# EasyEDA Pro project Ai-Camera.eprj, schematic Schematic1

## Sheets
1 P1: Board Name: Board1; Create Date: 2025-08-22; Page Name: P1; Project Name: Ai-Camera; Schematic Name: Schematic1; Update Date: 2026-03-01; Company: EasyEDA.com; Page Size: A4; Version: V1.0
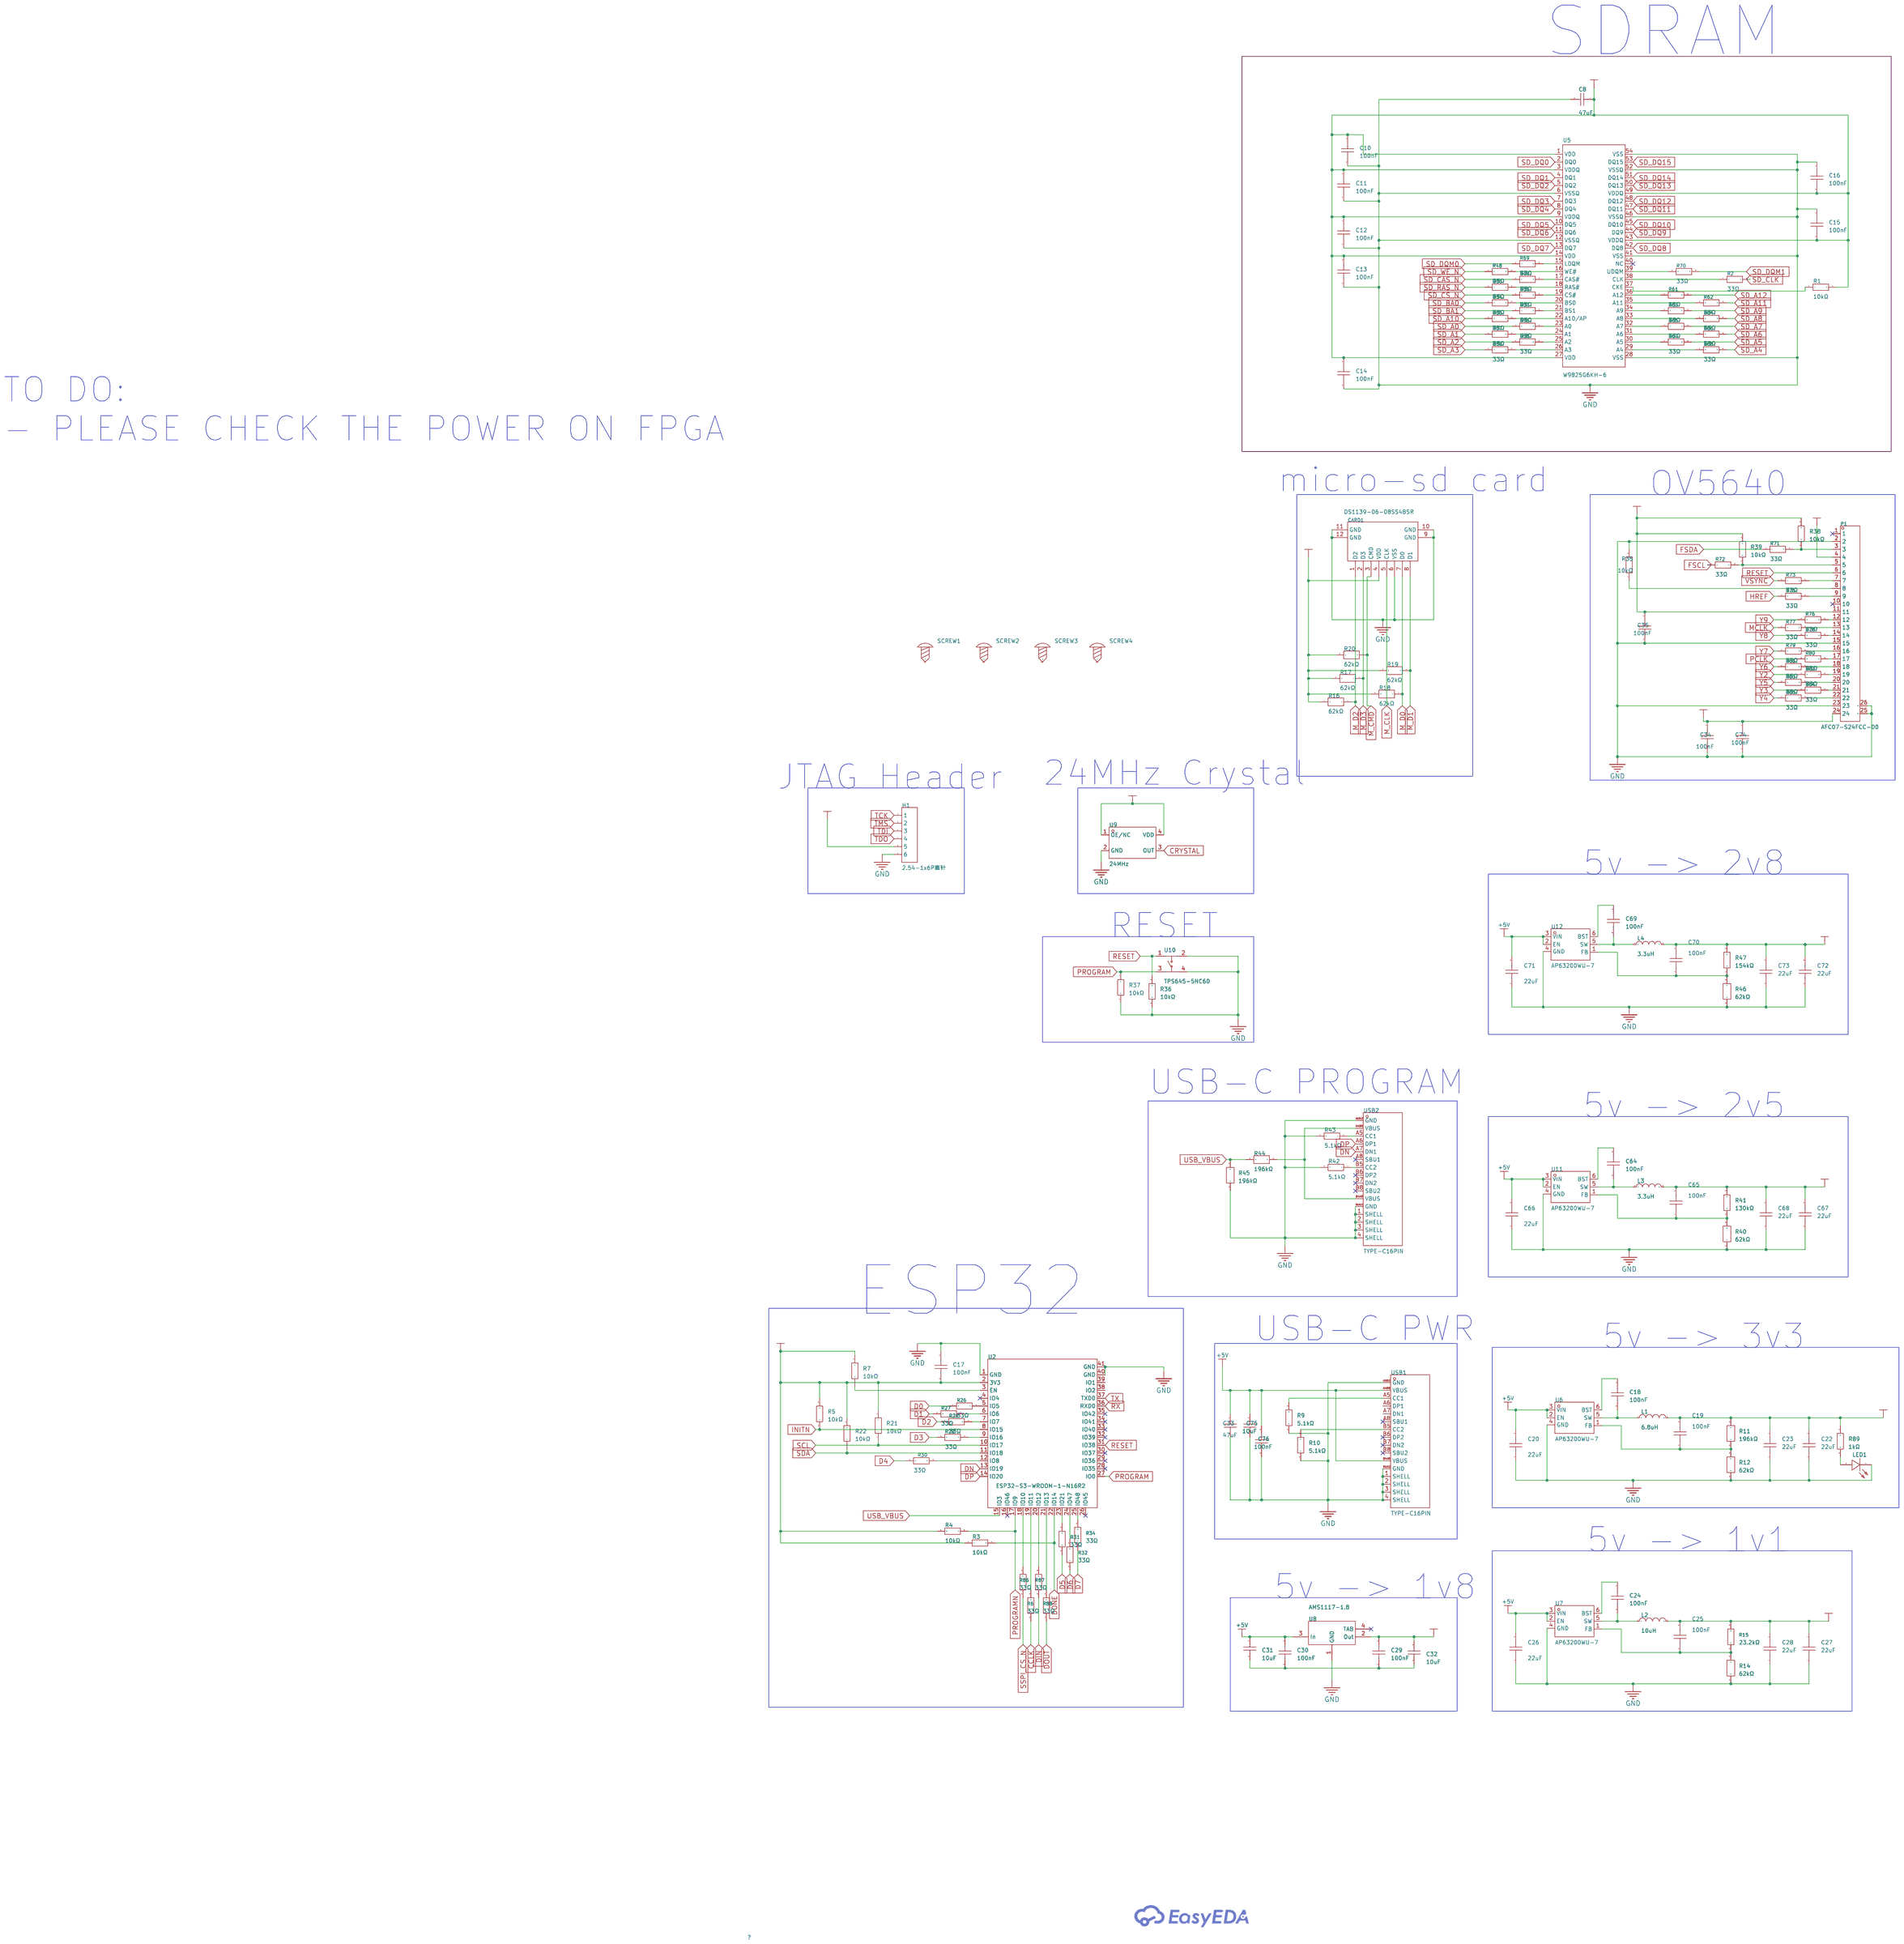
[diagram p0: P1]
2 FPGA: Create Date: 2026-01-28; Page Name: FPGA; Update Date: 2026-02-28
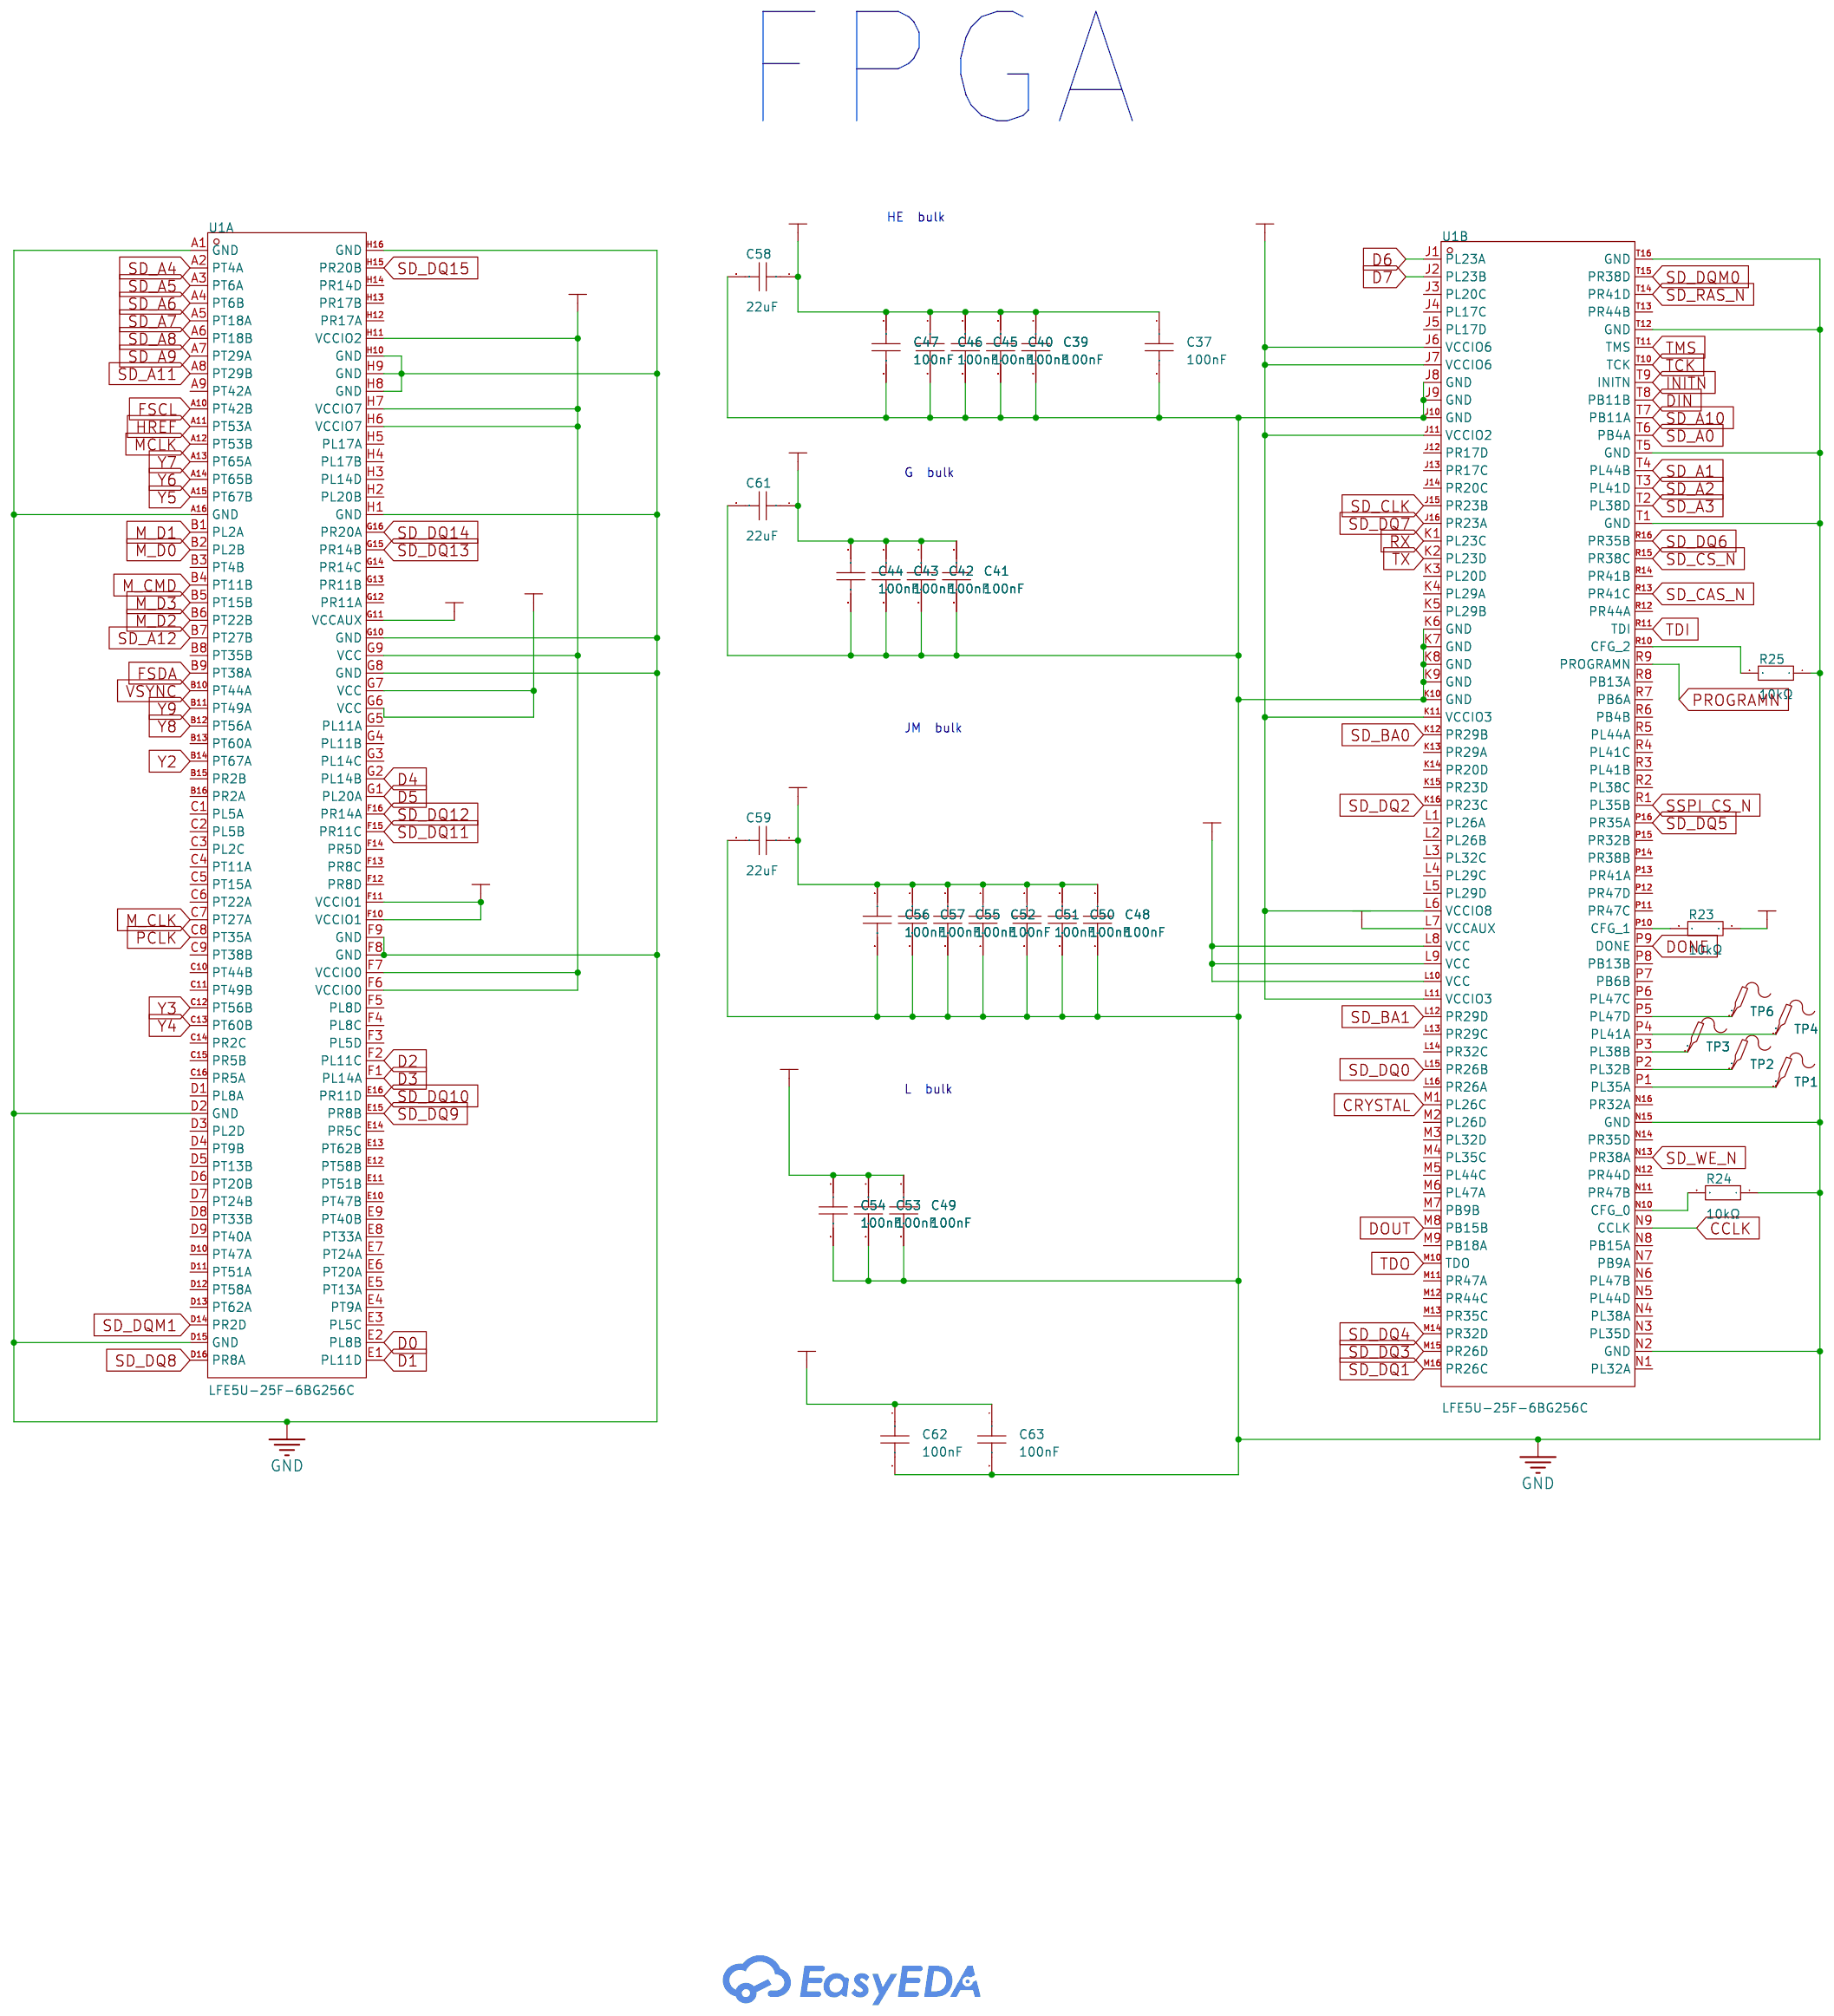
[diagram p1: FPGA]

## Parts
sheet FPGA
C37  100nF  [C01005]
C39  100nF  [C01005]
C40  100nF  [C01005]
C41  100nF  [C01005]
C42  100nF  [C01005]
C43  100nF  [C01005]
C44  100nF  [C01005]
C45  100nF  [C01005]
C46  100nF  [C01005]
C47  100nF  [C01005]
C48  100nF  [C01005]
C49  100nF  [C01005]
C50  100nF  [C01005]
C51  100nF  [C01005]
C52  100nF  [C01005]
C53  100nF  [C01005]
C54  100nF  [C01005]
C55  100nF  [C01005]
C56  100nF  [C01005]
C57  100nF  [C01005]
C58  22uF  [C0603]
C59  22uF  [C0603]
C61  22uF  [C0603]
C62  100nF  [C01005]
C63  100nF  [C01005]
R23  10kΩ  [R0402]
R24  10kΩ  [R0402]
R25  10kΩ  [R0402]
TP1  -  [Test-Point-0.5mm]
TP2  -  [Test-Point-0.5mm]
TP3  -  [Test-Point-0.5mm]
TP4  -  [Test-Point-0.5mm]
TP6  -  [Test-Point-0.5mm]
U1  LFE5U-25F-6BG256C  [CABGA-256_L14.0-W14.0-R16-C16-P0.80-TL]  (sections 1,2)
sheet P1
C8  47uF  [C0805]
C10  100nF  [C01005]
C11  100nF  [C01005]
C12  100nF  [C01005]
C13  100nF  [C01005]
C14  100nF  [C01005]
C15  100nF  [C01005]
C16  100nF  [C01005]
C17  100nF  [C01005]
C18  100nF  [C01005]
C19  100nF  [C0603]
C20  22uF  [C0603]
C22  22uF  [C0603]
C23  22uF  [C0603]
C24  100nF  [C01005]
C25  100nF  [C0603]
C26  22uF  [C0603]
C27  22uF  [C0603]
C28  22uF  [C0603]
C29  100nF  [C01005]
C30  100nF  [C01005]
C31  10uF  [C0402]
C32  10uF  [C0402]
C33  47uF  [C0805]
C34  100nF  [C01005]
C35  100nF  [C01005]
C64  100nF  [C01005]
C65  100nF  [C0603]
C66  22uF  [C0603]
C67  22uF  [C0603]
C68  22uF  [C0603]
C69  100nF  [C01005]
C70  100nF  [C0603]
C71  22uF  [C0603]
C72  22uF  [C0603]
C73  22uF  [C0603]
C74  100nF  [C01005]
C75  10uF  [C0402]
C76  100nF  [C01005]
CARD1  DS1139-06-08SS4BSR  [TF-SMD_DS1139-06-08SS4BSR]
H1  2.54-1x6P直针  [HDR-TH_6P-P2.54-V-M-1]
L1  6.8uH  [IND-SMD_L7.0-W6.6]
L2  10uH  [IND-SMD_L7.3-W6.8]
L3  3.3uH  [IND-SMD_L4.5-W4.1_SL0420]
L4  3.3uH  [IND-SMD_L4.5-W4.1_SL0420]
LED1  -  [LED0805-RD_RED]
P1  AFC07-S24FCC-00  [FPC-SMD_AFC07-S24FCC-00]
R1  10kΩ  [R0402]
R2  33Ω  [R0402]
R3  10kΩ  [R0402]
R4  10kΩ  [R0402]
R5  10kΩ  [R0402]
R6  33Ω  [R0402]
R7  10kΩ  [R0402]
R9  5.1kΩ  [R0603]
R10  5.1kΩ  [R0603]
R11  196kΩ  [R0603]
R12  62kΩ  [R0603]
R14  62kΩ  [R0603]
R15  23.2kΩ  [R0603]
R16  62kΩ  [R0603]
R17  62kΩ  [R0603]
R18  62kΩ  [R0603]
R19  62kΩ  [R0603]
R20  62kΩ  [R0603]
R21  10kΩ  [R0402]
R22  10kΩ  [R0402]
R26  33Ω  [R0402]
R27  33Ω  [R0402]
R28  33Ω  [R0402]
R29  33Ω  [R0402]
R30  33Ω  [R0402]
R31  33Ω  [R0402]
R32  33Ω  [R0402]
R34  33Ω  [R0402]
R35  10kΩ  [R0402]
R36  10kΩ  [R0402]
R37  10kΩ  [R0402]
R38  10kΩ  [R0402]
R39  10kΩ  [R0402]
R40  62kΩ  [R0603]
R41  130kΩ  [R0402]
R42  5.1kΩ  [R0603]
R43  5.1kΩ  [R0603]
R44  196kΩ  [R0603]
R45  196kΩ  [R0603]
R46  62kΩ  [R0603]
R47  154kΩ  [R0402]
R48  33Ω  [R0402]
R49  33Ω  [R0402]
R50  33Ω  [R0402]
R51  33Ω  [R0402]
R53  33Ω  [R0402]
R54  33Ω  [R0402]
R55  33Ω  [R0402]
R56  33Ω  [R0402]
R57  33Ω  [R0402]
R58  33Ω  [R0402]
R59  33Ω  [R0402]
R61  33Ω  [R0402]
R62  33Ω  [R0402]
R63  33Ω  [R0402]
R64  33Ω  [R0402]
R65  33Ω  [R0402]
R66  33Ω  [R0402]
R67  33Ω  [R0402]
R68  33Ω  [R0402]
R69  33Ω  [R0402]
R70  33Ω  [R0402]
R71  33Ω  [R0402]
R72  33Ω  [R0402]
R73  33Ω  [R0402]
R75  33Ω  [R0402]
R76  33Ω  [R0402]
R77  33Ω  [R0402]
R78  33Ω  [R0402]
R79  33Ω  [R0402]
R80  33Ω  [R0402]
R81  33Ω  [R0402]
R82  33Ω  [R0402]
R83  33Ω  [R0402]
R84  33Ω  [R0402]
R85  33Ω  [R0402]
R86  33Ω  [R0402]
R87  33Ω  [R0402]
R88  33Ω  [R0402]
R89  1kΩ  [R1206]
SCREW1  -  [Screw-Hole-M2]
SCREW2  -  [Screw-Hole-M3]
SCREW3  -  [Screw-Hole-M3]
SCREW4  -  [Screw-Hole-M3]
U2  ESP32-S3-WROOM-1-N16R2  [WIRELM-SMD_ESP32-S3-WROOM-1]
U5  W9825G6KH-6  [TSOP-54_L22.2-W10.2-P0.80-LS11.8-BL]
U6  AP63200WU-7  [SOT-23-6_L2.9-W1.6-P0.95-LS2.8-BR]
U7  AP63200WU-7  [SOT-23-6_L2.9-W1.6-P0.95-LS2.8-BR]
U8  AMS1117-1.8  [SOT-223-4_L6.5-W3.5-P2.30-LS7.0-BR]
U9  24MHz  [OSC-SMD_4P-L3.2-W2.5-BL]
U10  TPS645-5NC60  [SW-SMD_4P-L6.0-W6.0-P4.50-LS9.2]
U11  AP63200WU-7  [SOT-23-6_L2.9-W1.6-P0.95-LS2.8-BR]
U12  AP63200WU-7  [SOT-23-6_L2.9-W1.6-P0.95-LS2.8-BR]
USB1  TYPE-C16PIN  [USB-C-SMD_TYPE-C16PIN]
USB2  TYPE-C16PIN  [USB-C-SMD_TYPE-C16PIN]

## Library data of the parts
C10-C18 C24 C29 C30 C34 C35 C37 C39-C57 C62-C64 C69 C74 C76 = GRM022R60J104KE15D: LCSC Part Name: 100nF ±10% 6.3V; Supplier Part: C161362; Manufacturer: muRata(村田); Supplier Footprint: 01005; JLCPCB Part Class: Extended Part; Datasheet: https://atta.szlcsc.com/upload/public/pdf/source/20200305/C490387_23319AE8C154DEB24C505E6C82A8106A.pdf; Supplier: LCSC; Tolerance: ±10%; Voltage Rating: 6.3V; Temperature Coefficient: X5R
C20 C22 C23 C26-C28 C58 C59 C61 C66-C68 C71-C73 = TCC0603X5R226M6R3CT: LCSC Part Name: 22uF ±20% 6.3V; Supplier Part: C380323; Manufacturer: CCTC(三环); Supplier Footprint: 0603; JLCPCB Part Class: Extended Part; Datasheet: https://item.szlcsc.com/datasheet/TCC0603X5R226M6R3CT/352728.html; Supplier: LCSC; Tolerance: ±20%; Voltage Rating: 6.3V; Temperature Coefficient: X5R
R1 R3-R5 R7 R21-R25 R35-R39 = 0402WGF1002TCE: LCSC Part Name: 10kΩ ±1% 62.5mW 厚膜电阻; Supplier Part: C25744; Manufacturer: UNI-ROYAL(厚声); Supplier Footprint: 0402; JLCPCB Part Class: Basic Part; Datasheet: https://item.szlcsc.com/datasheet/0402WGF1002TCE/26487.html; Supplier: LCSC; Type: Thick Film Resistor; Tolerance: ±1%; Power(Watts): 62.5mW; Voltage-Supply(Max): 50V; Temperature Coefficient: ±100ppm/℃; Operating Temperature: -55℃~+155℃
TP1-TP4 TP6 = Test-Point
U1 = LFE5U-25F-6BG256C: LCSC Part Name: LFE5U 25F 6BG256C; Supplier Part: C1521614; Manufacturer: LATTICE(莱迪思); Supplier Footprint: CABGA-256; JLCPCB Part Class: Extended Part; Datasheet: https://atta.szlcsc.com/upload/public/pdf/source/20221202/6704A1754335A6F4ED4829569A52AB14.pdf; Supplier: LCSC; Logic Elements / Cells: 24000; Logic Array Blocks: 6000; Embedded Block RAM: 1032192bit; Operating Temperature Range: 0℃~+85℃
C8 C33 = CL21A476MQYNNNE: LCSC Part Name: 47uF ±20% 6.3V; Supplier Part: C16780; Manufacturer: SAMSUNG(三星); Supplier Footprint: 0805; JLCPCB Part Class: Basic Part; Datasheet: https://item.szlcsc.com/datasheet/CL21A476MQYNNNE/17464.html; Supplier: LCSC; Tolerance: ±20%; Voltage Rating: 6.3V; Temperature Coefficient: X5R
C19 C25 C65 C70 = TCC0603X7R104K500CT: LCSC Part Name: 100nF ±10% 50V; Supplier Part: C282519; Manufacturer: CCTC(三环); Supplier Footprint: 0603; JLCPCB Part Class: Extended Part; Datasheet: https://item.szlcsc.com/datasheet/TCC0603X7R104K500CT/268639.html; Supplier: LCSC; Tolerance: ±10%; Voltage Rating: 50V; Temperature Coefficient: X7R
C31 C32 C75 = GRM155R60J106ME44D: LCSC Part Name: 10uF ±20% 6.3V; Supplier Part: C76991; Manufacturer: muRata(村田); Supplier Footprint: 0402; JLCPCB Part Class: Extended Part; Datasheet: https://item.szlcsc.com/datasheet/GRM155R60J106ME44D/78118.html; Supplier: LCSC; Tolerance: ±20%; Voltage Rating: 6.3V; Temperature Coefficient: X5R
CARD1 = DS1139-06-08SS4BSR: LCSC Part Name: 翻盖式 MicroSD卡(TF卡) 卡座; Supplier Part: C86574; Manufacturer: CONNFLY; Supplier Footprint: SMD; JLCPCB Part Class: Extended Part; Datasheet: https://item.szlcsc.com/datasheet/DS1139-06-08SS4BSR/87751.html; Supplier: LCSC; Card Connection Mode: Hinged Lid; Card Type: MicroSD Card (TF Card); Connector Type: Connector and Ejector
H1 = 2.54-1x6P直针: LCSC Part Name: 1x6P 间距:2.54mm 方针 直插; Supplier Part: C37208; Manufacturer: BOOMELE(博穆精密); Supplier Footprint: 插件,P=2.54mm; JLCPCB Part Class: Extended Part; Datasheet: https://item.szlcsc.com/datasheet/2.54-1x6P%25E7%259B%25B4%25E9%2592%2588/38187.html; Supplier: LCSC; Pin Structure: 1x6P; Pitch: 2.54mm; Circluar Pins/Square Pins: Pin Header; Mounting Type: Through Hole; Number of Rows: 1; Number of Pins: 6P; Current Rating: 3A; Length of Mating Pin: 6mm; Insulation Height: 2.5mm; Length of End Connection Pin: 3mm; Contact Material: Brass; Contact Plating: Gold; Operating Temperature: -40℃~+105℃; Color: Black
L1 = FXL0630-6R8-M: LCSC Part Name: 6.8uH ±20% 6A; Supplier Part: C167221; Manufacturer: cjiang(长江微电); Supplier Footprint: SMD,7x6.6mm; JLCPCB Part Class: Extended Part; Datasheet: https://item.szlcsc.com/datasheet/FXL0630-6R8-M/178604.html; Supplier: LCSC; Tolerance: ±20%; Current Rating: 5A; Current - Saturation(Isat): 6A; DC Resistance(DCR): 48mΩ; Type: Molded Inductor
L2 = FXL0630-100-M: LCSC Part Name: 10uH ±20% 5.5A; Supplier Part: C167223; Manufacturer: cjiang(长江微电); Supplier Footprint: SMD,6.6x7mm; JLCPCB Part Class: Extended Part; Datasheet: https://atta.szlcsc.com/upload/public/pdf/source/20240426/3189EA8206330E2108542F9E34E540E7.pdf; Supplier: LCSC; Tolerance: ±20%; Saturation Current (Isat): 5.5A; Type: Integrated molded inductor
L3 L4 = SL0420-3R3M: LCSC Part Name: 3.3uH ±20% 4A; Supplier Part: C22463807; Manufacturer: 台湾陆海; Supplier Footprint: SMD,4.5x4.1mm; JLCPCB Part Class: Extended Part; Datasheet: https://item.szlcsc.com/datasheet/SL0420-3R3M/24154949.html; Supplier: LCSC; Tolerance: ±20%; Current Rating: 3.5A; Current - Saturation (Isat): 4A
LED1 = NCD0805R1: LCSC Part Name: 红灯; Supplier Part: C84256; Manufacturer: 国星光电; Supplier Footprint: 0805; JLCPCB Part Class: Basic Part; Datasheet: https://atta.szlcsc.com/upload/public/pdf/source/20200820/C84256_F0A75A43B3EAD75808600A0514C76B99.pdf; Supplier: LCSC; Emitted Color: 红灯
P1 = AFC07-S24FCC-00: LCSC Part Name: 间距:0.5mm P数:24P 抽屉式 下接; Supplier Part: C11057; Manufacturer: JS(钜硕电子); Supplier Footprint: SMD,P=0.5mm,卧贴; JLCPCB Part Class: Extended Part; Datasheet: https://item.szlcsc.com/datasheet/AFC07-S24FCC-00/11604.html; Supplier: LCSC; Locking Feature: Slide Lock; Contact Type: Bottom Contact; Number of Contacts: 24P; Pitch: 0.5mm; Mounting Type: Surface Mount, Right Angle; FFC, FCB Thickness: 0.3mm; Height Above Board: 2mm
R2 R6 R26-R32 R34 R48-R51 R53-R59 R61-R73 R75-R88 = 0402WGF330JTCE: LCSC Part Name: 33Ω ±1% 62.5mW 厚膜电阻; Supplier Part: C25105; Manufacturer: UNI-ROYAL(厚声); Supplier Footprint: 0402; JLCPCB Part Class: Basic Part; Datasheet: https://item.szlcsc.com/datasheet/0402WGF330JTCE/25848.html; Supplier: LCSC; Type: Thick Film Resistor; Tolerance: ±1%; Power(Watts): 62.5mW; Voltage-Supply(Max): 50V; Temperature Coefficient: ±100ppm/℃; Operating Temperature: -55℃~+155℃
R9 R10 R42 R43 = 0603WAF5101T5E: LCSC Part Name: 5.1kΩ ±1% 100mW 厚膜电阻; Supplier Part: C23186; Manufacturer: UNI-ROYAL(厚声); Supplier Footprint: 0603; JLCPCB Part Class: Basic Part; Datasheet: https://item.szlcsc.com/datasheet/0603WAF5101T5E/23913.html; Supplier: LCSC; Type: Thick Film Resistor; Tolerance: ±1%; Power(Watts): 100mW; Voltage-Supply(Max): 75V; Temperature Coefficient: ±100ppm/℃; Operating Temperature: -55℃~+155℃
R11 R44 R45 = FRC0603F1963TS: LCSC Part Name: 196kΩ ±1% 100mW 厚膜电阻; Supplier Part: C2974032; Manufacturer: FOJAN(富捷); Supplier Footprint: 0603; JLCPCB Part Class: Extended Part; Supplier: LCSC; Type: Thick Film Resistor; Tolerance: ±1%; Power(Watts): 100mW; Voltage-Supply(Max): 75V; Temperature Coefficient: ±100ppm/℃; Operating Temperature: -55℃~+155℃
R12 R14 R16-R20 R40 R46 = FRC0603F6202TS: LCSC Part Name: 62kΩ ±1% 100mW 厚膜电阻; Supplier Part: C2907059; Manufacturer: FOJAN(富捷); Supplier Footprint: 0603; JLCPCB Part Class: Extended Part; Supplier: LCSC; Type: Thick Film Resistor; Tolerance: ±1%; Power(Watts): 100mW; Voltage-Supply(Max): 75V; Temperature Coefficient: ±100ppm/℃; Operating Temperature: -55℃~+155℃
R15 = 0603WAF2322T5E: LCSC Part Name: 23.2kΩ ±1% 100mW 厚膜电阻; Supplier Part: C23346; Manufacturer: UNI-ROYAL(厚声); Supplier Footprint: 0603; JLCPCB Part Class: Extended Part; Datasheet: https://item.szlcsc.com/datasheet/0603WAF2322T5E/24079.html; Supplier: LCSC; Type: Thick Film Resistor; Tolerance: ±1%; Power(Watts): 100mW; Voltage-Supply(Max): 75V; Temperature Coefficient: ±100ppm/℃; Operating Temperature: -55℃~+155℃
R41 = RC0402FR-07130KL: LCSC Part Name: 厚膜电阻 130kΩ ±1% 62.5mW; Supplier Part: C93946; Manufacturer: YAGEO(国巨); Supplier Footprint: 0402; JLCPCB Part Class: Extended Part; Datasheet: https://item.szlcsc.com/datasheet/RC0402FR-07130KL/95144.html; Supplier: LCSC; Type: Thick Film Resistor; Tolerance: ±1%; Power(Watts): 62.5mW; Voltage-Supply(Max): 50V; Temperature Coefficient: ±100ppm/℃; Operating Temperature: -55℃~+155℃
R47 = 0402WGF1543TCE: LCSC Part Name: 154kΩ ±1% 62.5mW 厚膜电阻; Supplier Part: C26993; Manufacturer: UNI-ROYAL(厚声); Supplier Footprint: 0402; JLCPCB Part Class: Extended Part; Datasheet: https://item.szlcsc.com/datasheet/0402WGF1543TCE/27742.html; Supplier: LCSC; Type: Thick Film Resistor; Tolerance: ±1%; Power(Watts): 62.5mW; Voltage-Supply(Max): 50V; Temperature Coefficient: ±100ppm/℃; Operating Temperature: -55℃~+155℃
R89 = 1206W4J0102T5E: LCSC Part Name: 1kΩ ±5%; Supplier Part: C1469; Manufacturer: UNI-ROYAL(厚声); Supplier Footprint: 1206; JLCPCB Part Class: Extended Part; Datasheet: https://atta.szlcsc.com/upload/public/pdf/source/20200306/C422600_1E6D84923E4A46A82E41ADD87F860B5C.pdf; Supplier: LCSC; Type: Thick Film Resistors; Power(Watts): 250mW
SCREW1 = Screw-Hole-M2: Supplier Footprint: 插件
SCREW2-SCREW4 = Screw-Hole-M3: Supplier Footprint: 插件
U2 = ESP32-S3-WROOM-1-N16R2: LCSC Part Name: 通用型Wi-Fi+低功耗蓝牙MCU模组; Supplier Part: C2913205; Manufacturer: ESPRESSIF(乐鑫); Supplier Footprint: SMD,25.5x18mm; JLCPCB Part Class: Extended Part; Datasheet: https://item.szlcsc.com/datasheet/ESP32-S3-WROOM-1-N16R2/3198303.html; Supplier: LCSC
U5 = W9825G6KH-6: LCSC Part Name: 4M×4存储体×16位SDRAM; Supplier Part: C62246; Manufacturer: Winbond(华邦); Supplier Footprint: TSOP-54-10.2mm; JLCPCB Part Class: Extended Part; Datasheet: https://item.szlcsc.com/datasheet/W9825G6KH-6/63303.html; Supplier: LCSC; Memory Size: 256Mbit; Clock Frequency: 166MHz; Voltage - Supply: 3V~3.6V; Operating Temperature: 0℃~+70℃
U6 U7 U11 U12 = AP63200WU-7: Function:Buck Voltage - Supply:3.8V~32V Voltage - Supply:3.8V~32V Output Voltage:- Output Voltage:- Output Current:2A Frequency - Switching:500kHz Frequency - Switching:500kHz Operating Temperature:-40℃~+85℃ Operating Temperature:-40℃~+85℃ Synchronous Rec; LCSC Part Name: 3.8V至32V输入、2A低静态电流同步降压转换器，增强EMI抑制; Supplier Part: C2071868; Manufacturer: DIODES(美台); Supplier Footprint: TSOT-23-6; JLCPCB Part Class: Extended Part; Datasheet: https://item.szlcsc.com/datasheet/AP63200WU-7/2163451.html; Supplier: LCSC; Function: Buck; Voltage - Supply: 3.8V~32V; Output Current: 2A; Frequency - Switching: 500kHz; Operating Temperature: -40℃~+85℃; Synchronous Rectifier: Yes; Number of Outputs: 1; Topology: Buck; Quiescent Current: 22uA; Switch tube (built-in/external): Built-In; Output Type: Adjustable
U8 = AMS1117-1.8_C6185: LCSC Part Name: 输入15V 输出1.8V 1A; Supplier Part: C6185; Manufacturer: AMS; Supplier Footprint: SOT-223; JLCPCB Part Class: Extended Part; Datasheet: https://item.szlcsc.com/datasheet/AMS1117-1.8/6651.html; Supplier: LCSC; Output Type: Fixed; Voltage - Supply: 15V; Output Voltage: 1.8V; Output Current: 1A; Power Supply Rejection Ratio (PSRR): 72dB@(120Hz); Voltage Dropout: 1.3V@(1A); Noise: 0.003%Vout; Operating Temperature: -40℃~+125℃@(Tj); Output Configuration: Positive; Number of Outputs: 1
U9 = XOS32024000LT00351005: LCSC Part Name: 24MHz 4P 3225 1.8V-3.3V ±10PPM -40~85℃ (±20PPM) CMOS; Supplier Part: C37635416; Manufacturer: 同晶; Supplier Footprint: SMD3225-4P; JLCPCB Part Class: Extended Part; Datasheet: https://item.szlcsc.com/datasheet/XOS32024000LT00351005/39361348.html; Supplier: LCSC; Normal temperature Frequency Tolerance: ±10ppm; Output Type: CMOS; Voltage - Supply: 1.62V~3.63V; Current - Supply: 5mA; Frequency Stability: ±20ppm; Operating Temperature: -40℃~+85℃
U10 = TPS645-5NC60: LCSC Part Name: 6X6X6H 260克力 贴片轻触开关; Supplier Part: C19191552; Manufacturer: ROCPU Switches(台普); JLCPCB Part Class: Extended Part; Datasheet: https://atta.szlcsc.com/upload/public/pdf/source/20231204/193B3ACAB5A471A76A9359FBA22C7A2C.pdf; Supplier: LCSC
USB1 USB2 = TYPE-C16PIN: LCSC Part Name: Type-C 母 卧贴; Supplier Part: C393939; Manufacturer: SHOU HAN(首韩); Supplier Footprint: SMD; JLCPCB Part Class: Extended Part; Datasheet: https://item.szlcsc.com/datasheet/TYPE-C16PIN/372551.html; Supplier: LCSC; Connector Type: Type-C; Protocol Standard: USB 3.1; Gender: Female; Mounting Type: Surface Mount, Right Angle; Number of Contacts: 16P; Number of Ports: 1; Current Rating-Power: 3A; Voltage Rating: 30V; Connect-Disconnect Life: 10,000 Cycles; Detection color: Black; Operating Temperature: -40℃~+85℃

## Nets
+1V1: C25.2 C27.2 C28.2 C41.1 C42.1 C43.1 C44.1 C49.1 C53.1 C54.1 C61.1 L2.2 R15.2 U1.G6(VCC) U1.G7(VCC) U1.L8(VCC) U1.L9(VCC) U1.L10(VCC)
+1V8: C29.1 C32.2 C35.1 C62.1 C63.1 P1.11 R38.2 R39.2 U1.F10(VCCIO1) U1.F11(VCCIO1) U8.2(Out)
+2V5: C65.2 C67.2 C68.2 L3.2 R41.2 U1.G11(VCCAUX) U1.L7(VCCAUX)
+2V8: C34.1 C70.2 C72.2 C73.2 C74.1 L4.2 P1.4 P1.24 R47.2
+3V3: C8.1 C10.1 C11.1 C12.1 C13.1 C14.1 C15.2 C16.2 C17.2 C19.2 C22.2 C23.2 C37.1 C39.1 C40.1 C45.1 C46.1 C47.1 C48.1 C50.1 C51.1 C52.1 C55.1 C56.1 C57.1 C58.1 C59.1 CARD1.4(VDD) H1.5 L1.2 R1.2 R3.1 R4.1 R5.2 R7.2 R11.2 R16.2 R17.2 R18.2 R19.2 R20.2 R21.2 R22.2 R23.1 R89.1 U1.F6(VCCIO0) U1.F7(VCCIO0) U1.G9(VCC) U1.H6(VCCIO7) U1.H7(VCCIO7) U1.H11(VCCIO2) U1.J6(VCCIO6) U1.J7(VCCIO6) U1.J11(VCCIO2) U1.K11(VCCIO3) U1.L6(VCCIO8) U1.L11(VCCIO3) U2.2(3V3) U5.1(VDD) U5.3(VDDQ) U5.9(VDDQ) U5.14(VDD) U5.27(VDD) U5.43(VDDQ) U5.49(VDDQ) U9.1(OE/NC) U9.4(VDD)
+5V: C20.2 C26.2 C30.1 C31.2 C33.2 C66.2 C71.2 C75.2 C76.1 U6.2(EN) U6.3(VIN) U7.2(EN) U7.3(VIN) U8.3(In) U11.2(EN) U11.3(VIN) U12.2(EN) U12.3(VIN) USB1.A4B9(VBUS) USB1.B4A9(VBUS)
GND: C8.2 C10.2 C11.2 C12.2 C13.2 C14.2 C15.1 C16.1 C17.1 C20.1 C22.1 C23.1 C26.1 C27.1 C28.1 C33.1 C34.2 C35.2 C37.2 C39.2 C40.2 C41.2 C42.2 C43.2 C44.2 C45.2 C46.2 C47.2 C48.2 C49.2 C50.2 C51.2 C52.2 C53.2 C54.2 C55.2 C56.2 C57.2 C58.2 C59.2 C61.2 C62.2 C63.2 C66.1 C67.1 C68.1 C71.1 C72.1 C73.1 C74.2 C75.1 C76.2 CARD1.6(VSS) CARD1.9(GND) CARD1.10(GND) CARD1.11(GND) CARD1.12(GND) H1.6 LED1.1(-) P1.2 P1.15 P1.23 P1.25 P1.26 R9.1 R10.1 R12.1 R14.1 R24.1 R25.1 R35.2 R36.2 R37.2 R40.1 R42.2 R43.2 R45.1 R46.1 U1.A1(GND) U1.A16(GND) U1.D2(GND) U1.D15(GND) U1.F8(GND) U1.F9(GND) U1.G8(GND) U1.G10(GND) U1.H1(GND) U1.H8(GND) U1.H9(GND) U1.H10(GND) U1.H16(GND) U1.J8(GND) U1.J9(GND) U1.J10(GND) U1.K6(GND) U1.K7(GND) U1.K8(GND) U1.K9(GND) U1.K10(GND) U1.N2(GND) U1.N15(GND) U1.T1(GND) U1.T5(GND) U1.T12(GND) U1.T16(GND) U2.1(GND) U2.40(GND) U2.41(GND) U5.6(VSSQ) U5.12(VSSQ) U5.28(VSS) U5.41(VSS) U5.46(VSSQ) U5.52(VSSQ) U5.54(VSS) U6.4(GND) U7.4(GND) U8.1(GND) U9.2(GND) U10.2 U10.4 U11.4(GND) U12.4(GND) USB1.1(SHELL) USB1.2(SHELL) USB1.3(SHELL) USB1.4(SHELL) USB1.A1B12(GND) USB1.B1A12(GND) USB2.1(SHELL) USB2.2(SHELL) USB2.3(SHELL) USB2.4(SHELL) USB2.A1B12(GND) USB2.B1A12(GND)
CCLK: R6.1 U1.N9(CCLK)
CRYSTAL: U1.M1(PL26C) U9.3(OUT)
D0: R26.1 U1.E2(PL8B)
D1: R27.1 U1.E1(PL11D)
D2: R28.1 U1.F2(PL11C)
D3: R29.1 U1.F1(PL14A)
D4: R30.1 U1.G2(PL14B)
D5: R31.1 U1.G1(PL20A)
D6: R32.1 U1.J1(PL23A)
D7: R34.1 U1.J2(PL23B)
DIN: R87.1 U1.T8(PB11B)
DN: U2.13(IO19) USB2.A7(DN1)
DONE: R3.2 U1.P9(DONE) U2.22(IO14)
DOUT: R88.1 U1.M8(PB15B)
DP: U2.14(IO20) USB2.A6(DP1)
FSCL: R72.1 U1.A10(PT42B)
FSDA: R71.1 U1.B9(PT38A)
HREF: R75.1 U1.A11(PT53A)
INITN: R5.1 U1.T9(INITN) U2.8(IO15)
M_CLK: CARD1.5(CLK) U1.C7(PT27A)
M_CMD: CARD1.3(CMD) R20.1 U1.B4(PT11B)
M_D0: CARD1.7(D0) R18.1 U1.B2(PL2B)
M_D1: CARD1.8(D1) R19.1 U1.B1(PL2A)
M_D2: CARD1.1(D2) R16.1 U1.B6(PT22B)
M_D3: CARD1.2(D3) R17.1 U1.B5(PT15B)
MCLK: R77.1 U1.A12(PT53B)
PCLK: R80.1 U1.C8(PT35A)
PROGRAM: R37.1 U2.27(IO0) U10.3
PROGRAMN: R4.2 U1.R9(PROGRAMN) U2.17(IO9)
RESET: P1.6 R36.1 U2.31(IO38) U10.1
RX: U1.K1(PL23C) U2.36(RXD0)
SCL: R21.1 U2.10(IO17)
SD_A0: R56.1 U1.T6(PB4A)
SD_A1: R57.1 U1.T4(PL44B)
SD_A2: R58.1 U1.T3(PL41D)
SD_A3: R59.1 U1.T2(PL38D)
SD_A4: R68.2 U1.A2(PT4A)
SD_A5: R67.2 U1.A3(PT6A)
SD_A6: R66.2 U1.A4(PT6B)
SD_A7: R65.2 U1.A5(PT18A)
SD_A8: R64.2 U1.A6(PT18B)
SD_A9: R63.2 U1.A7(PT29A)
SD_A10: R55.1 U1.T7(PB11A)
SD_A11: R62.2 U1.A8(PT29B)
SD_A12: R61.2 U1.B7(PT27B)
SD_BA0: R54.1 U1.K12(PR29B)
SD_BA1: R53.1 U1.L12(PR29D)
SD_CAS_N: R49.1 U1.R13(PR41C)
SD_CLK: R2.2 U1.J15(PR23B)
SD_CS_N: R51.1 U1.R15(PR38C)
SD_DQ0: U1.L15(PR26B) U5.2(DQ0)
SD_DQ1: U1.M16(PR26C) U5.4(DQ1)
SD_DQ2: U1.K16(PR23C) U5.5(DQ2)
SD_DQ3: U1.M15(PR26D) U5.7(DQ3)
SD_DQ4: U1.M14(PR32D) U5.8(DQ4)
SD_DQ5: U1.P16(PR35A) U5.10(DQ5)
SD_DQ6: U1.R16(PR35B) U5.11(DQ6)
SD_DQ7: U1.J16(PR23A) U5.13(DQ7)
SD_DQ8: U1.D16(PR8A) U5.42(DQ8)
SD_DQ9: U1.E15(PR8B) U5.44(DQ9)
SD_DQ10: U1.E16(PR11D) U5.45(DQ10)
SD_DQ11: U1.F15(PR11C) U5.47(DQ11)
SD_DQ12: U1.F16(PR14A) U5.48(DQ12)
SD_DQ13: U1.G15(PR14B) U5.50(DQ13)
SD_DQ14: U1.G16(PR20A) U5.51(DQ14)
SD_DQ15: U1.H15(PR20B) U5.53(DQ15)
SD_DQM0: R69.1 U1.T15(PR38D)
SD_DQM1: R70.2 U1.D14(PR2D)
SD_RAS_N: R50.1 U1.T14(PR41D)
SD_WE_N: R48.1 U1.N13(PR38A)
SDA: R22.1 U2.11(IO18)
SSPI_CS_N: R86.1 U1.R1(PL35B)
TCK: H1.1 U1.T10(TCK)
TDI: H1.3 U1.R11(TDI)
TDO: H1.4 U1.M10(TDO)
TMS: H1.2 U1.T11(TMS)
TX: U1.K2(PL23D) U2.37(TXD0)
USB_VBUS: R44.1 R45.2 U2.15(IO3)
VSYNC: R73.1 U1.B10(PT44A)
Y2: R82.1 U1.B14(PT67A)
Y3: R84.1 U1.C12(PT56B)
Y4: R85.1 U1.C13(PT60B)
Y5: R83.1 U1.A15(PT67B)
Y6: R81.1 U1.A14(PT65B)
Y7: R79.1 U1.A13(PT65A)
Y8: R78.1 U1.B12(PT56A)
Y9: R76.1 U1.B11(PT49A)
$1N9437: R1.1 U5.37(CKE)
$1N11348: R2.1 U5.38(CLK)
$1N11975: R7.1 U2.3(EN)
$1N12553: R10.2 USB1.B5(CC2)
$1N12557: R9.2 USB1.A5(CC1)
$1N14416: C18.2 L1.1 U6.5(SW)
$1N14459: C18.1 U6.6(BST)
$1N14567: C19.1 R11.1 R12.2 U6.1(FB)
$1N16832: C24.2 L2.1 U7.5(SW)
$1N16833: C24.1 U7.6(BST)
$1N16834: C25.1 R14.2 R15.1 U7.1(FB)
$1N17349: C29.2 C30.2 C31.1 C32.1
$1N29790: R26.2 U2.5(IO5)
$1N29833: R27.2 U2.6(IO6)
$1N29916: R29.2 U2.9(IO16)
$1N29959: R30.2 U2.12(IO8)
$1N30002: R31.2 U2.23(IO21)
$1N30085: R34.2 U2.25(IO48)
$1N30089: R32.2 U2.24(IO47)
$1N30093: R28.2 U2.7(IO7)
$1N60668: C64.1 U11.6(BST)
$1N60669: C64.2 L3.1 U11.5(SW)
$1N60670: C65.1 R40.2 R41.1 U11.1(FB)
$1N63749: R43.1 USB2.A5(CC1)
$1N63772: R42.1 USB2.B5(CC2)
$1N63825: R44.2 USB2.A4B9(VBUS) USB2.B4A9(VBUS)
$1N64401: C69.2 L4.1 U12.5(SW)
$1N64402: C69.1 U12.6(BST)
$1N64403: C70.1 R46.2 R47.1 U12.1(FB)
$1N71242: R48.2 U5.16(WE#)
$1N71285: R49.2 U5.17(CAS#)
$1N71328: R50.2 U5.18(RAS#)
$1N71371: R51.2 U5.19(CS#)
$1N71457: R53.2 U5.21(BS1)
$1N71500: R54.2 U5.20(BS0)
$1N74645: R55.2 U5.22(A10/AP)
$1N74688: R56.2 U5.23(A0)
$1N74731: R57.2 U5.24(A1)
$1N74774: R58.2 U5.25(A2)
$1N74817: R59.2 U5.26(A3)
$1N74931: R61.1 U5.36(A12)
$1N74974: R62.1 U5.35(A11)
$1N75017: R63.1 U5.34(A9)
$1N75060: R64.1 U5.33(A8)
$1N75103: R65.1 U5.32(A7)
$1N75146: R66.1 U5.31(A6)
$1N75189: R67.1 U5.30(A5)
$1N75232: R68.1 U5.29(A4)
$1N75310: R69.2 U5.15(LDQM)
$1N75353: R70.1 U5.39(UDQM)
$1N78998: P1.7 R73.2
$1N79046: P1.8 R35.1
$1N79086: P1.9 R75.2
$1N79129: P1.12 R76.2
$1N79172: P1.13 R77.2
$1N79215: P1.14 R78.2
$1N79258: P1.16 R79.2
$1N79301: P1.17 R80.2
$1N79344: P1.18 R81.2
$1N79387: P1.19 R82.2
$1N79430: P1.20 R83.2
$1N79473: P1.21 R84.2
$1N79516: P1.22 R85.2
$1N79529: P1.3 R38.1 R71.2
$1N79537: P1.5 R39.1 R72.2
$1N79556: R6.2 U2.19(IO11)
$1N79602: R86.2 U2.18(IO10)
$1N79645: R87.2 U2.20(IO12)
$1N79688: R88.2 U2.21(IO13)
$1N87876: LED1.2(+) R89.2
$2N5507: R23.2 U1.P10(CFG_1)
$2N5509: R24.2 U1.N10(CFG_0)
$2N5511: R25.2 U1.R10(CFG_2)
$2N13986: TP1.1 U1.P1(PL35A)
$2N14062: TP2.1 U1.P2(PL32B)
$2N14083: TP3.1 U1.P3(PL38B)
$2N14087: TP4.1 U1.P4(PL41A)
$2N14129: TP6.1 U1.P5(PL47D)

Not connected (* = marked no-connect by the designer): P1 1* 10*; SCREW1 1; SCREW2 1; SCREW3 1; SCREW4 1; U1 A9(PT42A) B3(PT4B) B8(PT35B) B13(PT60A) B15(PR2B) B16(PR2A) C1(PL5A) C2(PL5B) C3(PL2C) C4(PT11A) C5(PT15A) C6(PT22A) C9(PT38B) C10(PT44B) C11(PT49B) C14(PR2C) C15(PR5B) C16(PR5A) D1(PL8A) D3(PL2D) D4(PT9B) D5(PT13B) D6(PT20B) D7(PT24B) D8(PT33B) D9(PT40A) D10(PT47A) D11(PT51A) D12(PT58A) D13(PT62A) E3(PL5C) E4(PT9A) E5(PT13A) E6(PT20A) E7(PT24A) E8(PT33A) E9(PT40B) E10(PT47B) E11(PT51B) E12(PT58B) E13(PT62B) E14(PR5C) F3(PL5D) F4(PL8C) F5(PL8D) F12(PR8D) F13(PR8C) F14(PR5D) G3(PL14C) G4(PL11B) G5(PL11A) G12(PR11A) G13(PR11B) G14(PR14C) H2(PL20B) H3(PL14D) H4(PL17B) H5(PL17A) H12(PR17A) H13(PR17B) H14(PR14D) J3(PL20C) J4(PL17C) J5(PL17D) J12(PR17D) J13(PR17C) J14(PR20C) K3(PL20D) K4(PL29A) K5(PL29B) K13(PR29A) K14(PR20D) K15(PR23D) L1(PL26A) L2(PL26B) L3(PL32C) L4(PL29C) L5(PL29D) L13(PR29C) L14(PR32C) L16(PR26A) M2(PL26D) M3(PL32D) M4(PL35C) M5(PL44C) M6(PL47A) M7(PB9B) M9(PB18A) M11(PR47A) M12(PR44C) M13(PR35C) N1(PL32A) N3(PL35D) N4(PL38A) N5(PL44D) N6(PL47B) N7(PB9A) N8(PB15A) N11(PR47B) N12(PR44D) N14(PR35D) N16(PR32A) P6(PL47C) P7(PB6B) P8(PB13B) P11(PR47C) P12(PR47D) P13(PR41A) P14(PR38B) P15(PR32B) R2(PL38C) R3(PL41B) R4(PL41C) R5(PL44A) R6(PB4B) R7(PB6A) R8(PB13A) R12(PR44A) R14(PR41B) T13(PR44B); U2 4(IO4)* 16(IO46)* 26(IO45)* 28(IO35)* 29(IO36)* 30(IO37)* 32(IO39)* 33(IO40)* 34(IO41)* 35(IO42)* 38(IO2) 39(IO1); U5 40(NC)*; U8 4(TAB)*; USB1 A6(DP1) A7(DN1) A8(SBU1)* B6(DP2)* B7(DN2)* B8(SBU2)*; USB2 A8(SBU1)* B6(DP2)* B7(DN2)* B8(SBU2)*

## Notes on the sheets
sheet 1
- SDRAM
- TO DO:
  - PLEASE CHECK THE POWER ON FPGA
- micro-sd card
- OV5640
- JTAG Header
- 24MHz Crystal
- 5v -> 2v8
- RESET
- USB-C PROGRAM
- 5v -> 2v5
- ESP32
- USB-C PWR
- 5v -> 3v3
- 5v -> 1v1
- 5v -> 1v8
sheet 2
- FPGA
- HE  bulk
- G  bulk
- JM  bulk
- L  bulk
